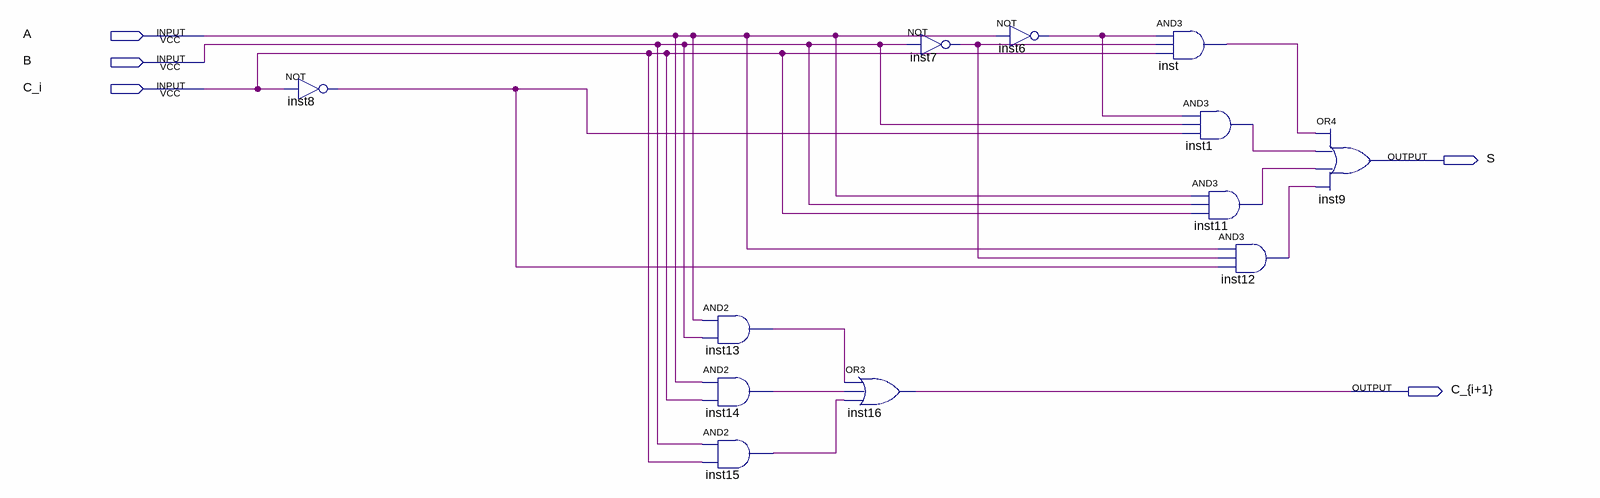
[diagram p0: schematic sheet]
// Quartus schematic One.bdf as structural Verilog: 12 symbols, 5 pins
module One (
  input  A,
  input  B,
  input  C_i,
  output S,
  output \C_{i+1} 
);

  wire inst1_out, inst6_out, inst7_out, inst8_out, inst11_out, inst12_out, inst13_out, inst14_out,
       inst15_out, inst_out;

  not inst8 (inst8_out, C_i);
  and inst13 (inst13_out, A, B);
  and inst14 (inst14_out, A, C_i);
  and inst15 (inst15_out, B, C_i);
  or inst16 (\C_{i+1} , inst13_out, inst14_out, inst15_out);
  not inst7 (inst7_out, B);
  not inst6 (inst6_out, A);
  and inst (inst_out, inst6_out, inst7_out, C_i);
  and inst1 (inst1_out, inst6_out, B, inst8_out);
  and inst11 (inst11_out, A, B, C_i);
  and inst12 (inst12_out, A, inst7_out, inst8_out);
  or inst9 (S, inst_out, inst1_out, inst11_out, inst12_out);
endmodule
